# Altium schematic sheet TPI_time_timer.SchDoc
size A2; SheetNumber: 1; SheetTotal: 1
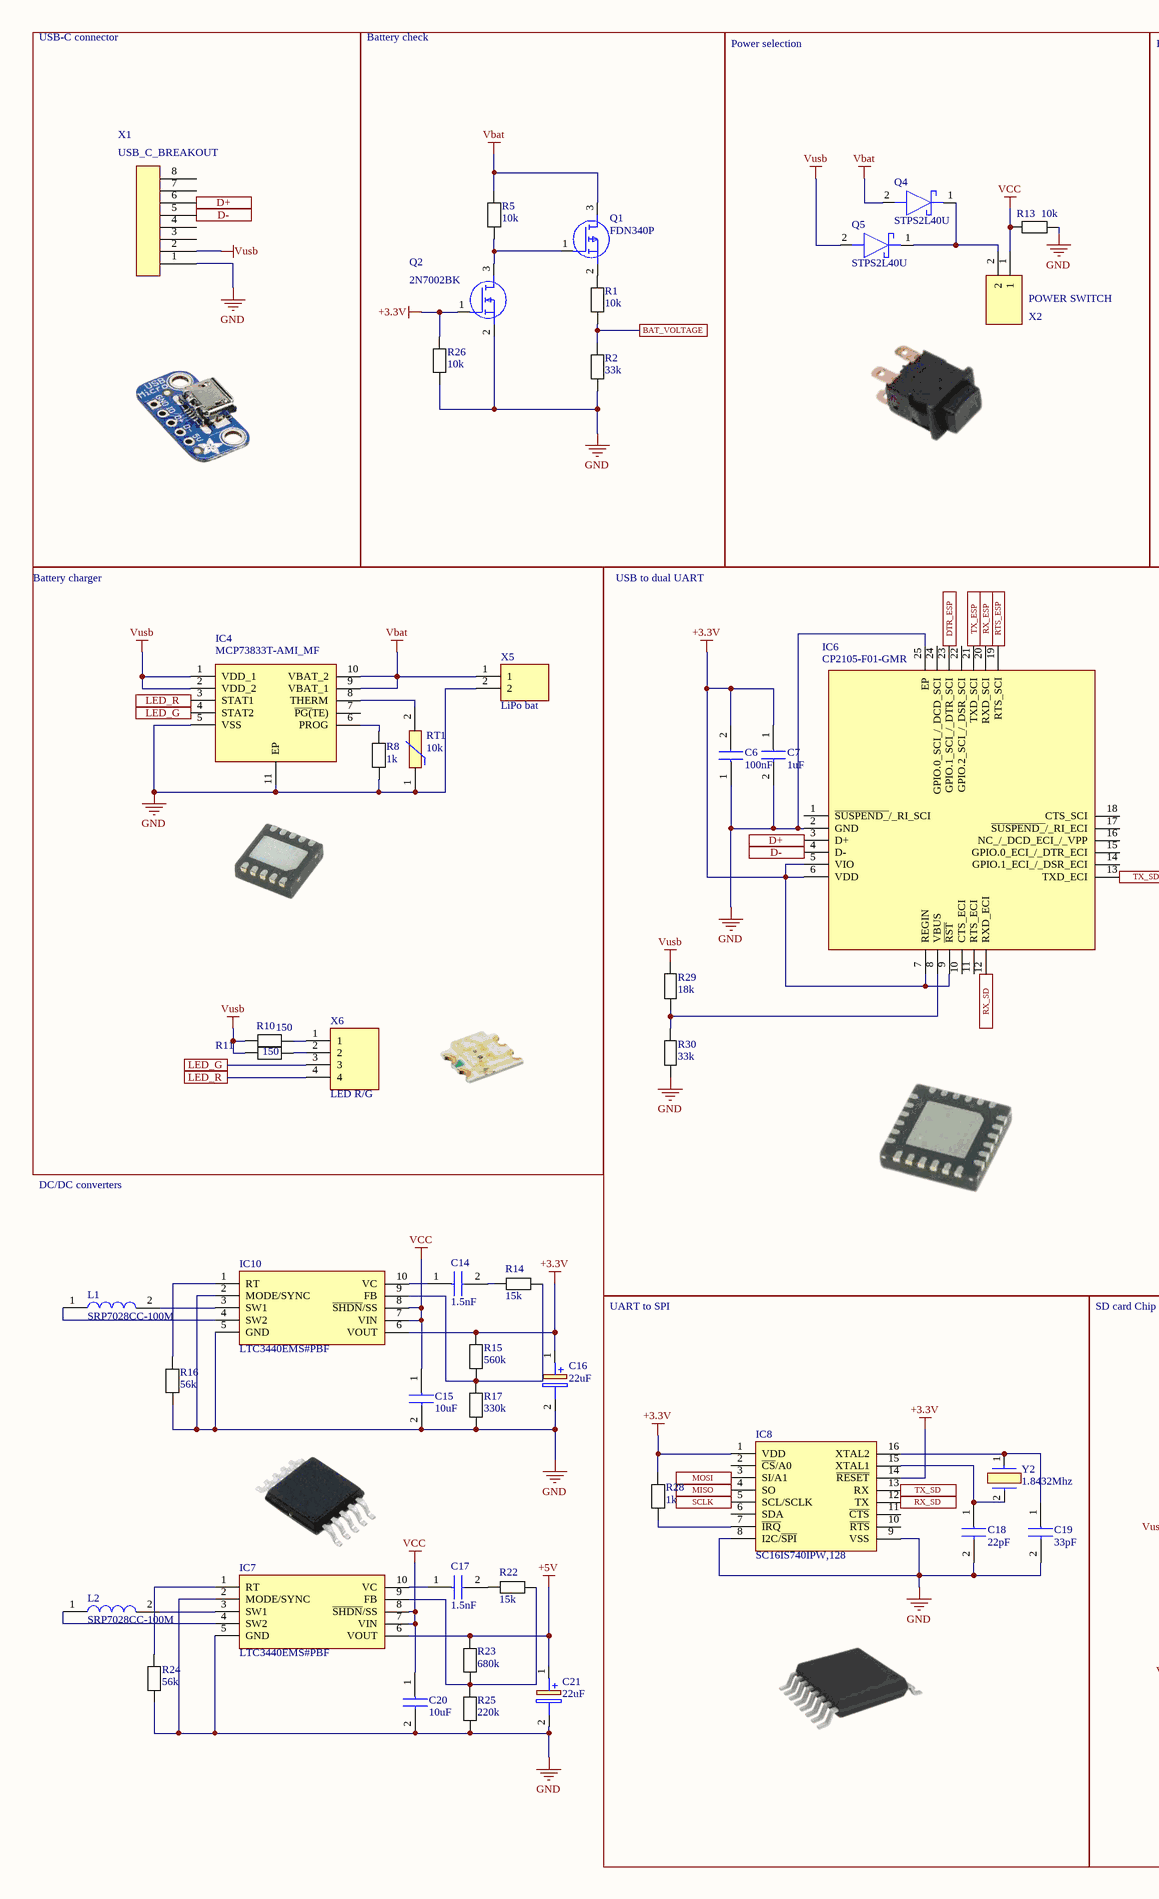
[diagram p0: TPI_time_timer.SchDoc, left]
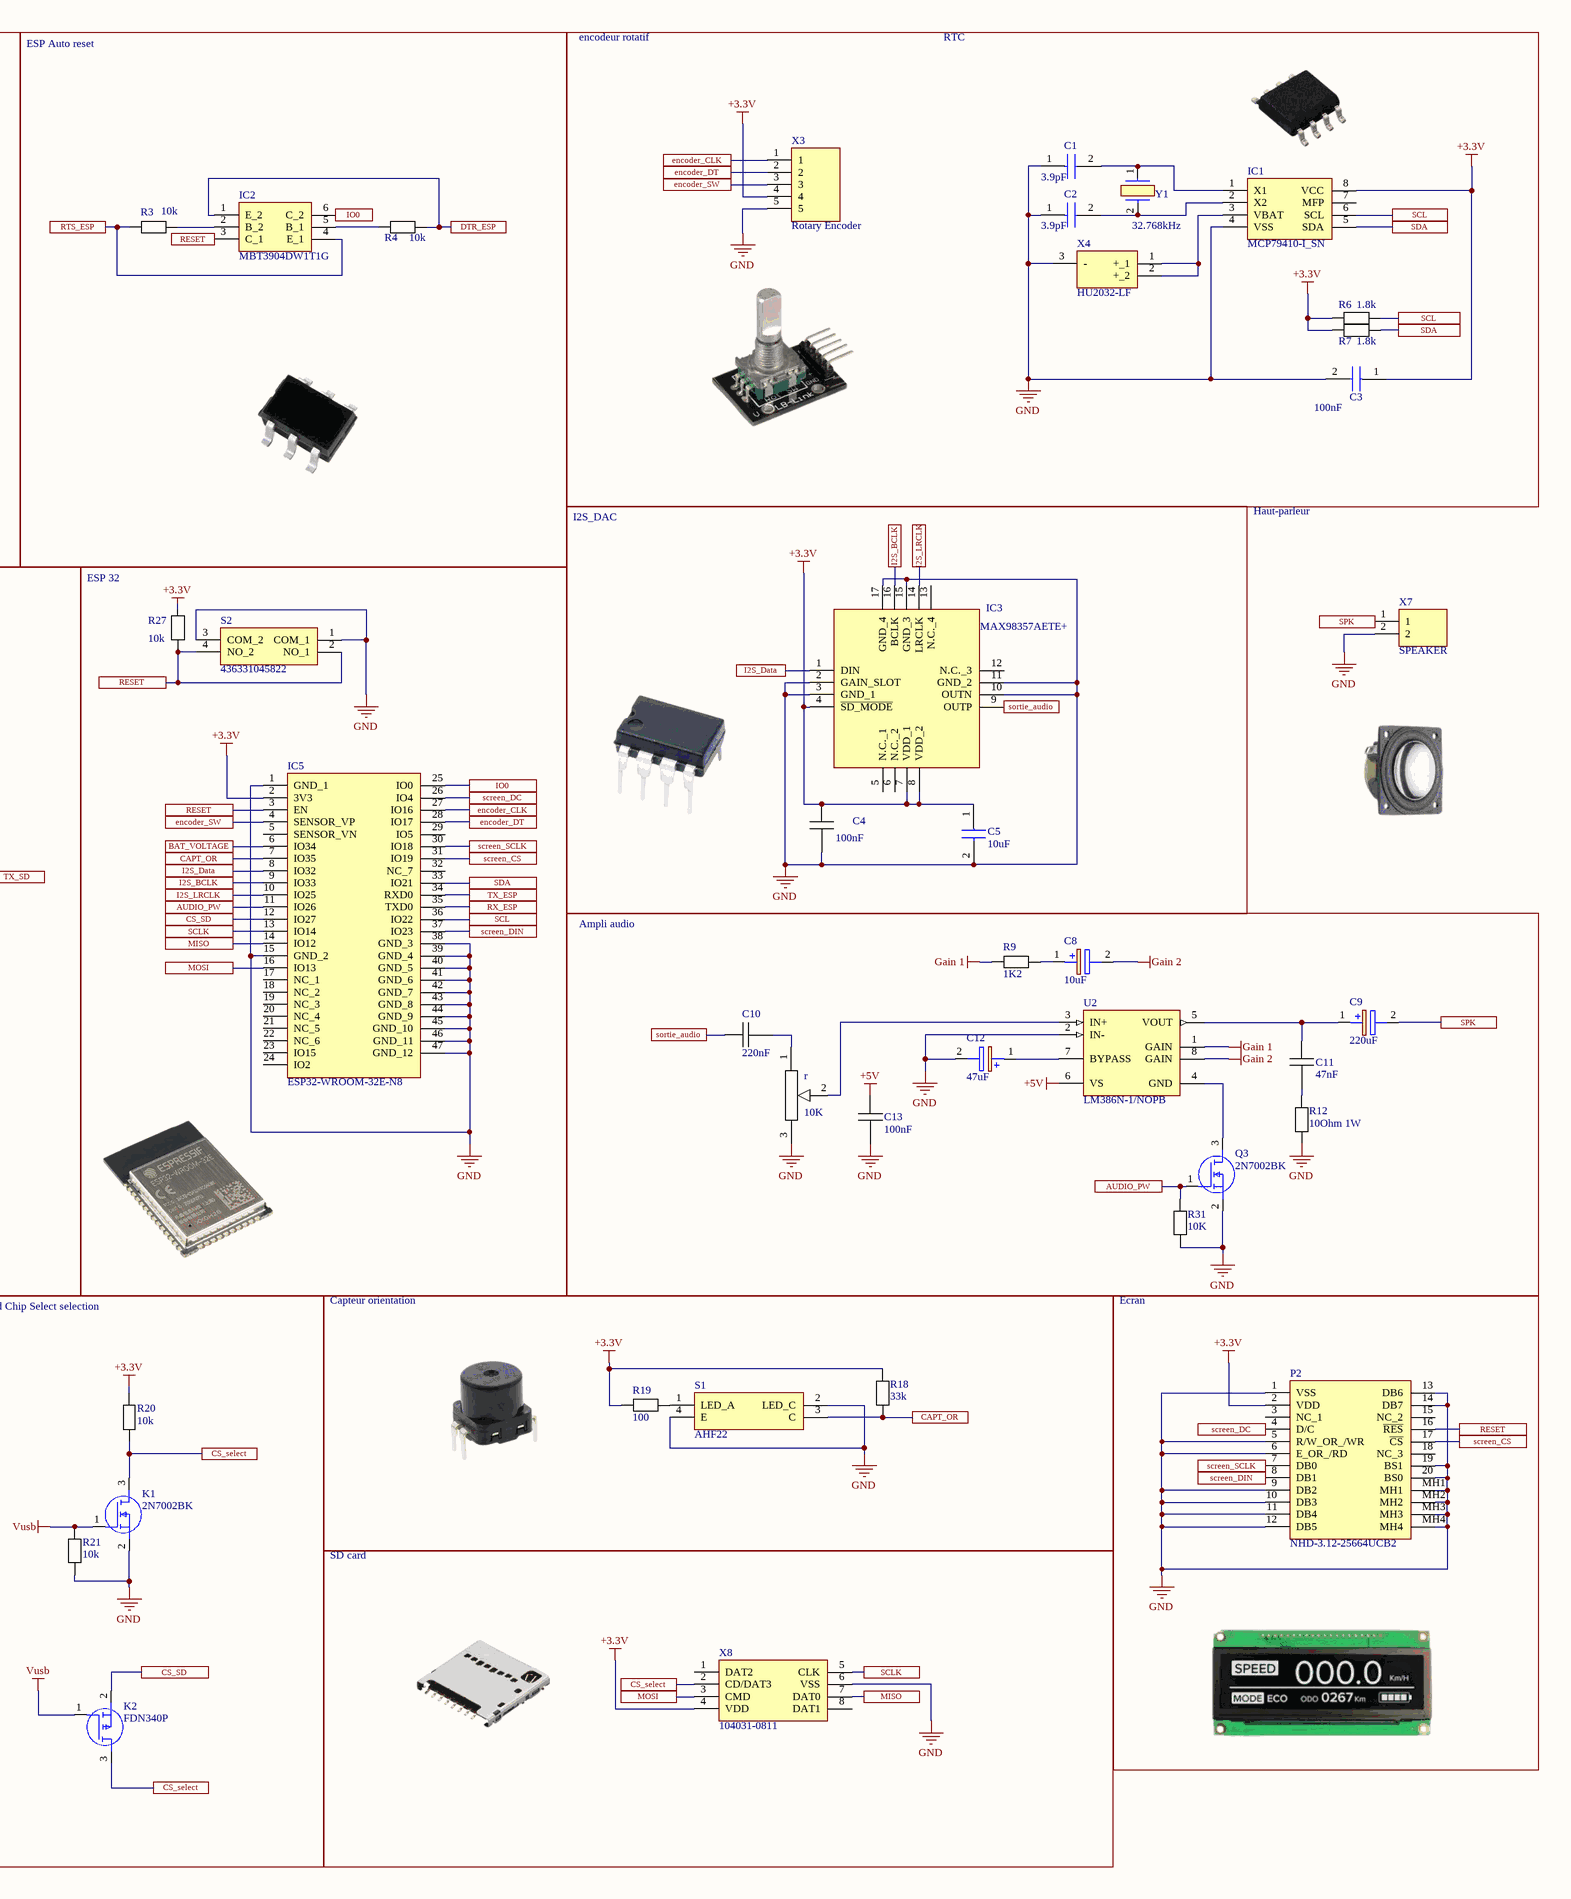
[diagram p1: TPI_time_timer.SchDoc, right]

## Parts
C1  3.9pF  [CAPC2012X88N]
C2  3.9pF  [CAPC2012X88N]
C3  100nF  [CAPC2012X94N]
C4  100nF  [MyCapacitor 1206 [SMD]]
C5  10uF  [C1206]
C6  100nF  [MyCapacitor 1206 [SMD]]
C7  1uF  [MyCapacitor 1206 [SMD]]
C8  10uF  [CAPAE530X550N]
C9  220uF  [CAPAE1030X1050N]
C10  220nF  [MyCapacitor 1206 [SMD]]
C11  47nF  [MyCapacitor 1206 [SMD]]
C12  47uF  [EEHZT1E561UV]
C13  100nF  [MyCapacitor 1206 [SMD]]
C14  1.5nF  [MyCapacitor 1206 [SMD]]
C15  10uF  [C1206]
C16  22uF  [CAPAE1030X1310N]
C17  1.5nF  [MyCapacitor 1206 [SMD]]
C18  22pF  [C1206]
C19  33pF  [C1206]
C20  10uF  [C1206]
C21  22uF  [CAPAE1030X1310N]
IC1  MCP79410-I_SN  [SOIC127P600X175-8N]
IC2  MBT3904DW1T1G  [SOT65P210X110-6N]
IC3  MAX98357AETE+  [QFN50P300X300X80-17N]
IC4  MCP73833T-AMI_MF  [SON50P300X300X100-11N-D]
IC5  ESP32-WROOM-32E-N8  [ESP32WROOM32EN8]
IC6  CP2105-F01-GMR  [QFN50P400X400X80-25N-D]
IC7  LTC3440EMS#PBF  [SOP50P490X110-10N]
IC8  SC16IS740IPW,128  [SOP65P640X110-16N]
IC10  LTC3440EMS#PBF  [SOP50P490X110-10N]
K1  2N7002BK  [TL431CDBZR215]
K2  FDN340P  [SOT95P251X112-3N]
L1  SRP7028CC-100M  [INDPM7366X300N]
L2  SRP7028CC-100M  [INDPM7366X300N]
P2  NHD-3.12-25664UCB2  [NHD31225664UCB2]
Q1  FDN340P  [SOT95P251X112-3N]
Q2  2N7002BK  [TL431CDBZR215]
Q3  2N7002BK  [TL431CDBZR215]
Q4  STPS2L40U  [DIOM5436X265N]
Q5  STPS2L40U  [DIOM5436X265N]
r  10K  [PVG3A103C01R00]
R1  10k  [Resistor 1206]
R2  33k  [Resistor 1206]
R3  10k  [Resistor 1206]
R4  10k  [Resistor 1206]
R5  10k  [Resistor 1206]
R6  1.8k  [Resistor 1206]
R7  1.8k  [Resistor 1206]
R8  1k  [Resistor 1206]
R9  1K2  [Resistor 1206]
R10  150  [Resistor 1206]
R11  150  [Resistor 1206]
R12  10Ohm 1W  [Resistor sandard tr.]
R13  10k  [Resistor 1206]
R14  15k  [Resistor 1206]
R15  560k  [Resistor 1206]
R16  56k  [Resistor 1206]
R17  330k  [Resistor 1206]
R18  33k  [Resistor 1206]
R19  100  [Resistor 1206]
R20  10k  [Resistor 1206]
R21  10k  [Resistor 1206]
R22  15k  [Resistor 1206]
R23  680k  [Resistor 1206]
R24  56k  [Resistor 1206]
R25  220k  [Resistor 1206]
R26  10k  [Resistor 1206]
R27  10k  [Resistor 1206]
R28  1k  [Resistor 1206]
R29  18k  [Resistor 1206]
R30  33k  [Resistor 1206]
R31  10K  [Resistor 1206]
RT1  10k  [NTCLE203E3103GB0]
S1  AHF22  [AHF22]
S2  436331045822  [436331045822]
U2  LM386N-1/NOPB  [P0008A]
X1  USB_C_BREAKOUT  [USB_C_BREAKOUT]
X2  POWER SWITCH  [B2BXHAMLFSN]
X3  Rotary Encoder  [B5BXHAMLFSN]
X4  HU2032-LF  [HU2032LF]
X5  LiPo bat  [B2BXHAMLFSN]
X6  LED R/G  [Header 4pin 2,54mm]
X7  SPEAKER  [B2BXHAMLFSN]
X8  104031-0811  [1040310811]
Y1  32.768kHz  [Q13FC1350000212]
Y2  1.8432Mhz  [CC1AT1A]

## Blocks framed on the sheet
USB-C connector: X1
Battery check: Q1 Q2 R1 R2 R5 R26
Power selection: Q4 Q5 R13 X2
ESP Auto reset: IC2 R3 R4
I2S_DAC: C4 C5 IC3
Battery charger: IC4 R8 R10 R11 RT1 X5 X6
USB to dual UART: C6 C7 IC6 R29 R30
ESP 32: IC5 R27 S2
Ampli audio: C8-C13 Q3 r R9 R12 R31 U2
UART to SPI: C18 C19 IC8 R28 Y2
SD card Chip Select selection: K1 K2 R20 R21
Capteur orientation: R18 R19 S1
Ecran: P2
SD card: X8

## Ports
AUDIO_PW (see TPI_time_timer[4B]), AUDIO_PW (see TPI_time_timer[7C]), BAT_VOLTAGE (see TPI_time_timer[2A]), BAT_VOLTAGE (see TPI_time_timer[4B]), CAPT_OR (see TPI_time_timer[4B]), CAPT_OR (see TPI_time_timer[7C]), CS_SD (see TPI_time_timer[4B]), CS_SD (see TPI_time_timer[4D]), CS_select (see TPI_time_timer[4D]), CS_select (see TPI_time_timer[4D], TPI_time_timer[6D]), D+ (see TPI_time_timer[1A]), D+ (see TPI_time_timer[3B]), D- (see TPI_time_timer[1A]), D- (see TPI_time_timer[3B]), DTR_ESP (see TPI_time_timer[3B]), DTR_ESP (see TPI_time_timer[5A]), encoder_CLK (see TPI_time_timer[5B]), encoder_CLK (see TPI_time_timer[6A]), encoder_DT (see TPI_time_timer[5B]), encoder_DT (see TPI_time_timer[6A]), encoder_SW (see TPI_time_timer[4B]), encoder_SW (see TPI_time_timer[6A]), I2S_BCLK (see TPI_time_timer[4B]), I2S_BCLK (see TPI_time_timer[6B]), I2S_Data (see TPI_time_timer[4B]), I2S_Data (see TPI_time_timer[6B]), I2S_LRCLK (see TPI_time_timer[4B]), I2S_LRCLK (see TPI_time_timer[7B]), IO0 (see TPI_time_timer[5A]), IO0 (see TPI_time_timer[5B]), LED_G (see TPI_time_timer[1B]), LED_G (see TPI_time_timer[1C]), LED_R (see TPI_time_timer[1B]), LED_R (see TPI_time_timer[1C]), MISO (see TPI_time_timer[3D], TPI_time_timer[4B]), MISO (see TPI_time_timer[3D], TPI_time_timer[6D]), MISO (see TPI_time_timer[4B], TPI_time_timer[6D]), MOSI (see TPI_time_timer[3D], TPI_time_timer[4C]), MOSI (see TPI_time_timer[3D], TPI_time_timer[6D]), MOSI (see TPI_time_timer[4C], TPI_time_timer[6D]), RESET (see TPI_time_timer[4A], TPI_time_timer[4B]), RESET (see TPI_time_timer[4A], TPI_time_timer[4B], TPI_time_timer[8D]), RESET (see TPI_time_timer[4B], TPI_time_timer[8D]), RTS_ESP (see TPI_time_timer[3B]), RTS_ESP (see TPI_time_timer[4A]), RX_ESP (see TPI_time_timer[3B]), RX_ESP (see TPI_time_timer[5B]), RX_SD (see TPI_time_timer[3C]), RX_SD (see TPI_time_timer[3D]), SCL (see TPI_time_timer[5B], TPI_time_timer[8A]), SCL (see TPI_time_timer[8A]), SCLK (see TPI_time_timer[3D], TPI_time_timer[4B]), SCLK (see TPI_time_timer[3D], TPI_time_timer[6D]), SCLK (see TPI_time_timer[4B], TPI_time_timer[6D]), screen_CS (see TPI_time_timer[5B]), screen_CS (see TPI_time_timer[8D]), screen_DC (see TPI_time_timer[5B]), screen_DC (see TPI_time_timer[7D]), screen_DIN (see TPI_time_timer[5B]), screen_DIN (see TPI_time_timer[7D]), screen_SCLK (see TPI_time_timer[5B]), screen_SCLK (see TPI_time_timer[7D]), SDA (see TPI_time_timer[5B], TPI_time_timer[8A]), SDA (see TPI_time_timer[8A]), sortie_audio (see TPI_time_timer[6C]), sortie_audio (see TPI_time_timer[7B]), SPK (see TPI_time_timer[8B]), SPK (see TPI_time_timer[8C]), TX_ESP (see TPI_time_timer[3B]), TX_ESP (see TPI_time_timer[5B]), TX_SD (see TPI_time_timer[3D]), TX_SD (see TPI_time_timer[4B])

## Nets
+3.3V: C3.1 C4.2 C5.1 C6.2 C7.1 C16.1(+) IC1.8(VCC) IC3.4(~{SD_MODE}) IC3.7(VDD_1) IC3.8(VDD_2) IC5.2(3V3) IC6.5(VIO) IC6.6(VDD) IC6.7(REGIN) IC6.9(~{RST}) IC8.1(VDD) IC8.14(~{RESET}) IC10.6(VOUT) P2.2(VDD) Q2.1(G) R6.2 R7.2 R15.1 R18.2 R19.2 R20.1 R26.1 R27.1 R28.1 X3.4 X8.4(VDD)
+5V: C13.2 C21.1(+) IC7.6(VOUT) R23.1 U2.6(VS)
Gain 1: R9.1 U2.1(GAIN)
Gain 2: C8.2(-) U2.8(GAIN)
GND: C1.1 C2.1 C3.2 C4.1 C5.2 C6.1 C7.2 C12.2(-_1) C13.1 C15.2 C16.2(-) C18.2 C19.2 C20.2 C21.2(-) IC1.4(VSS) IC3.2(GAIN_SLOT) IC3.3(GND_1) IC3.10(OUTN) IC3.11(GND_2) IC3.15(GND_3) IC3.17(GND_4) IC4.5(VSS) IC4.11(EP) IC5.1(GND_1) IC5.15(GND_2) IC5.38(GND_3) IC5.39(GND_4) IC5.40(GND_5) IC5.41(GND_6) IC5.42(GND_7) IC5.43(GND_8) IC5.44(GND_9) IC5.45(GND_10) IC5.46(GND_11) IC5.47(GND_12) IC6.2(GND) IC6.25(EP) IC7.2(MODE/SYNC) IC7.5(GND) IC8.8(I2C/~{SPI}) IC8.9(VSS) IC10.2(MODE/SYNC) IC10.5(GND) K1.2(S) P2.1(VSS) P2.5(R/W_OR_/WR) P2.6(E_OR_/RD) P2.9(DB2) P2.10(DB3) P2.11(DB4) P2.12(DB5) P2.13(DB6) P2.14(DB7) P2.19(BS1) P2.20(BS0) P2.MH1 P2.MH2 P2.MH3 P2.MH4 Q2.2(S) Q3.2(S) r.3 R2.2 R8.2 R12.2 R13.1 R16.2 R17.2 R21.1 R24.2 R25.2 R26.2 R30.1 R31.2 RT1.1 S1.2(LED_C) S1.4(E) S2.1(COM_1) S2.3(COM_2) U2.2(IN-) X1.1 X3.5 X4.3(-) X5.2 X7.2 X8.6(VSS)
Vbat: IC4.9(VBAT_1) IC4.10(VBAT_2) Q1.3(D) Q4.2(A) R5.1 X5.1
VCC: C15.1 C20.1 IC7.7(VIN) IC7.8(~{SHDN}/SS) IC10.7(VIN) IC10.8(~{SHDN}/SS) R13.2 X2.1
Vusb: IC4.1(VDD_1) IC4.2(VDD_2) K1.1(G) K2.1(G) Q5.2(A) R10.1 R11.1 R21.2 R29.2 X1.2
AUDIO_PW: IC5.11(IO26) Q3.1(G) R31.1 ; port AUDIO_PW
BAT_VOLTAGE: IC5.6(IO34) R1.2 R2.1 ; port BAT_VOLTAGE
CAPT_OR: IC5.7(IO35) R18.1 S1.3(C) ; port CAPT_OR
CS_SD: IC5.12(IO27) K2.2(S) ; port CS_SD
CS_select: K1.3(D) K2.3(D) R20.2 X8.2(CD/DAT3) ; port CS_select
D+: IC6.3(D+) X1.6 ; port D+
D-: IC6.4(D-) X1.5 ; port D-
DTR_ESP: IC2.1(E_2) IC6.23(GPIO.1_SCI_/_DTR_SCI) R4.2 ; port DTR_ESP
encoder_CLK: IC5.27(IO16) X3.1 ; port encoder_CLK
encoder_DT: IC5.28(IO17) X3.2 ; port encoder_DT
encoder_SW: IC5.4(SENSOR_VP) X3.3 ; port encoder_SW
I2S_BCLK: IC3.16(BCLK) IC5.9(IO33) ; port I2S_BCLK
I2S_Data: IC3.1(DIN) IC5.8(IO32) ; port I2S_Data
I2S_LRCLK: IC3.14(LRCLK) IC5.10(IO25) ; port I2S_LRCLK
IO0: IC2.6(C_2) IC5.25(IO0) ; port IO0
LED_G: IC4.4(STAT2) X6.3 ; port LED_G
LED_R: IC4.3(STAT1) X6.4 ; port LED_R
MISO: IC5.14(IO12) IC8.4(SO) X8.7(DAT0) ; port MISO
MOSI: IC5.16(IO13) IC8.3(SI/A1) X8.3(CMD) ; port MOSI
RESET: IC2.3(C_1) IC5.3(EN) P2.16(~{RES}) R27.2 S2.2(NO_1) S2.4(NO_2) ; port RESET
RTS_ESP: IC2.4(E_1) IC6.19(RTS_SCI) R3.1 ; port RTS_ESP
RX_ESP: IC5.35(TXD0) IC6.20(RXD_SCI) ; port RX_ESP
RX_SD: IC6.12(RXD_ECI) IC8.12(TX) ; port RX_SD
SCL: IC1.6(SCL) IC5.36(IO22) R6.1 ; port SCL
SCLK: IC5.13(IO14) IC8.5(SCL/SCLK) X8.5(CLK) ; port SCLK
screen_CS: IC5.31(IO19) P2.17(~{CS}) ; port screen_CS
screen_DC: IC5.26(IO4) P2.4(D/C) ; port screen_DC
screen_DIN: IC5.37(IO23) P2.8(DB1) ; port screen_DIN
screen_SCLK: IC5.30(IO18) P2.7(DB0) ; port screen_SCLK
SDA: IC1.5(SDA) IC5.33(IO21) R7.1 ; port SDA
sortie_audio: C10.2 IC3.9(OUTP) ; port sortie_audio
SPK: C9.2(-) X7.1 ; port SPK
TX_ESP: IC5.34(RXD0) IC6.21(TXD_SCI) ; port TX_ESP
TX_SD: IC6.13(TXD_ECI) IC8.13(RX) ; port TX_SD
NetC1_2: C1.2 IC1.1(X1) Y1.1
NetC2_2: C2.2 IC1.2(X2) Y1.2
NetC8_1: C8.1(+) R9.2
NetC9_1: C9.1(+) C11.2 U2.5(VOUT)
NetC10_1: C10.1 r.1
NetC11_1: C11.1 R12.1
NetC12_1: C12.1(+_1) U2.7(BYPASS)
NetC14_1: C14.1 IC10.10(VC)
NetC14_2: C14.2 R14.1
NetC17_1: C17.1 IC7.10(VC)
NetC17_2: C17.2 R22.1
NetC18_1: C18.1 IC8.15(XTAL1) Y2.2(OUTPUT)
NetC19_1: C19.1 IC8.16(XTAL2) Y2.1
NetIC1_3: IC1.3(VBAT) X4.1(+_1) X4.2(+_2)
NetIC2_2: IC2.2(B_2) R3.2
NetIC2_5: IC2.5(B_1) R4.1
NetIC4_6: IC4.6(PROG) R8.1
NetIC4_8: IC4.8(THERM) RT1.2
NetIC6_8: IC6.8(VBUS) R29.1 R30.2
NetIC7_1: IC7.1(RT) R24.1
NetIC7_3: IC7.3(SW1) L2.2
NetIC7_4: IC7.4(SW2) L2.1
NetIC7_9: IC7.9(FB) R22.2 R23.2 R25.1
NetIC8_7: IC8.7(~{IRQ}) R28.2
NetIC10_1: IC10.1(RT) R16.1
NetIC10_3: IC10.3(SW1) L1.2
NetIC10_4: IC10.4(SW2) L1.1
NetIC10_9: IC10.9(FB) R14.2 R15.2 R17.1
NetQ1_1: Q1.1(G) Q2.3(D) R5.2
NetQ1_2: Q1.2(S) R1.1
NetQ3_3: Q3.3(D) U2.4(GND)
NetQ4_1: Q4.1(K) Q5.1(K) X2.2
NetR10_2: R10.2 X6.1
NetR11_2: R11.2 X6.2
NetR19_1: R19.1 S1.1(LED_A)
Netr_2: r.2 U2.3(IN+)

Not connected (* = marked no-connect by the designer): IC1 7(MFP); IC3 5(N.C._1) 6(N.C._2) 12(N.C._3) 13(N.C._4); IC4 7(~{PG(}TE)); IC5 5(SENSOR_VN) 17(NC_1) 18(NC_2) 19(NC_3) 20(NC_4) 21(NC_5) 22(NC_6) 23(IO15) 24(IO2) 29(IO5) 32(NC_7); IC6 1(~{SUSPEND_}/_RI_SCI) 10(CTS_ECI) 11(RTS_ECI) 14(GPIO.1_ECI_/_DSR_ECI) 15(GPIO.0_ECI_/_DTR_ECI) 16(NC_/_DCD_ECI_/_VPP) 17(~{SUSPEND_}/_RI_ECI) 18(CTS_SCI) 22(GPIO.2_SCI_/_DSR_SCI) 24(GPIO.0_SCI_/_DCD_SCI); IC8 2(~{CS}/A0) 6(SDA) 10(~{RTS}) 11(~{CTS}); P2 3(NC_1) 15(NC_2) 18(NC_3); X1 3(65) 4(64) 7(61) 8(60); X8 1(DAT2) 8(DAT1)

## Notes on the sheet
- encodeur rotatif
- RTC
- Haut-parleur
- DC/DC converters

## Library data of the parts
C1 C2 = C0805C399D5GAC7800: Capacitor; Manufacturer_Name: KEMET; Datasheet Link: https://connect.kemet.com:7667/gateway/IntelliData-ComponentDocumentation/1.0/download/specsheet/C0805C399D5GACTU; Height: 0.88mm; Manufacturer_Part_Number: C0805C399D5GAC7800; Mouser Part Number: N/A; Mouser Price/Stock: https://www.mouser.co.uk/ProductDetail/KEMET/C0805C399D5GAC7800?qs=HB7DuPrg59p8fcBF%252BMtP%252BQ%3D%3D
C3 C6 = 08053C104MAT2A: Capacitor; Manufacturer_Name: AVX; Datasheet Link: https://spicat.kyocera-avx.com/product/mlcc/chartview/08053C104MAT2A/DataSheet/X7R; Height: 0.94mm; Manufacturer_Part_Number: 08053C104MAT2A; Mouser Part Number: 581-08053C104M; Mouser Price/Stock: https://www.mouser.co.uk/ProductDetail/AVX/08053C104MAT2A?qs=iAmswNBQWa3yww%252Bhw1tBQA%3D%3D; Arrow Part Number: 08053C104MAT2A; Arrow Price/Stock: https://www.arrow.com/en/products/08053c104mat2a/avx
C4 C10 C11 C13 = Condo non polarisé
C5 C7 C15 C18-C20 = C1206C106K4RACTU: Capacitor; Manufacturer_Name: KEMET; Datasheet Link: https://content.kemet.com/datasheets/KEM_C1002_X7R_SMD.pdf; Manufacturer_Part_Number: C1206C106K4RACTU; Mouser Part Number: 80-C1206C106K4R; Mouser Price/Stock: https://www.mouser.co.uk/ProductDetail/KEMET/C1206C106K4RACTU?qs=guDyKOyRtV0mxqxQedB7kA%3D%3D; Arrow Part Number: C1206C106K4RACTU; Arrow Price/Stock: https://www.arrow.com/en/products/c1206c106k4ractu/kemet-corporation?region=nac
C8 = 865230542002: Capacitor Polarised; Manufacturer_Name: Wurth Elektronik; Datasheet Link: http://katalog.we-online.com/pbs/datasheet/865230542002.pdf; Height: 5.5mm; Manufacturer_Part_Number: 865230542002; Mouser Part Number: 710-865230542002; Mouser Price/Stock: https://www.mouser.co.uk/ProductDetail/Wurth-Elektronik/865230542002?qs=0KOYDY2FL2%2F9Zrx1rvGWxQ%3D%3D
C9 = A785MN826M1JLAS030: Capacitor Polarised; Manufacturer_Name: KEMET; Datasheet Link: https://www.mouser.co.uk/datasheet/2/447/KEM_A4125_A785-3368732.pdf; Height: 10.5mm; Manufacturer_Part_Number: A785MN826M1JLAS030; Mouser Part Number: 80-A785MN826M1JLAS30; Mouser Price/Stock: https://www.mouser.co.uk/ProductDetail/KEMET/A785MN826M1JLAS030?qs=HoCaDK9Nz5cVflOfO51YlQ%3D%3D
C12 = EEH-ZA1K470V: Capacitor Polarised; Manufacturer_Name: Panasonic; Datasheet Link: http://industrial.panasonic.com/cdbs/www-data/pdf/RDD0000/ABA0000C1221.pdf; Height: 10.5mm; Manufacturer_Part_Number: EEH-ZA1K470V; Mouser Part Number: 667-EEH-ZA1K470V; Mouser Price/Stock: https://www.mouser.co.uk/ProductDetail/Panasonic/EEH-ZA1K470V?qs=1Kr7Jg1SGW%2FtZcuby2Gpxw%3D%3D
C14 C17 = C0402C152KCRACAUTO: Capacitor; Manufacturer_Name: KEMET; Datasheet Link: https://www.mouser.com/datasheet/2/447/KEM_C1076_X7R_HV_AUTO_SMD-3316842.pdf; Height: 0.6mm; Manufacturer_Part_Number: C0402C152KCRACAUTO; Mouser Part Number: 80-C0402C152KCRAUTO; Mouser Price/Stock: https://www.mouser.co.uk/ProductDetail/KEMET/C0402C152KCRACAUTO?qs=1Kr7Jg1SGW8RiYGiZabm2g%3D%3D
C16 C21 = PCM1J101MCL1GS: Capacitor Polarised; Manufacturer_Name: Nichicon; Datasheet Link: https://www.nichicon.co.jp/english/series_items/catalog_pdf/e-pcm.pdf; Height: 13.1mm; Manufacturer_Part_Number: PCM1J101MCL1GS
IC1 = MCP79410-I_SN: Integrated Circuit; Manufacturer_Name: Microchip; Manufacturer_Part_Number: MCP79410-I/SN; Datasheet Link: https://datasheet.datasheetarchive.com/originals/distributors/Datasheets-DGA3/278325.pdf; Height: 1.75mm; Mouser Part Number: 579-MCP79410-I/SN; Mouser Price/Stock: https://www.mouser.co.uk/ProductDetail/Microchip-Technology-Atmel/MCP79410-I-SN?qs=LU7oW20kJpNhp%252BQbxumdTQ%3D%3D; Arrow Part Number: MCP79410-I/SN; Arrow Price/Stock: https://www.arrow.com/en/products/mcp79410-isn/microchip-technology?region=nac
IC2 = MBT3904DW1T1G: Integrated Circuit; Manufacturer_Name: onsemi; Datasheet Link: http://www.onsemi.com/pub/Collateral/MBT3904DW1T1-D.PDF; Height: 1.1mm; Manufacturer_Part_Number: MBT3904DW1T1G; Mouser Part Number: 863-MBT3904DW1T1G; Mouser Price/Stock: https://www.mouser.co.uk/ProductDetail/onsemi/MBT3904DW1T1G?qs=3JMERSakebosaBSFCYL6kw%3D%3D; Arrow Part Number: MBT3904DW1T1G; Arrow Price/Stock: https://www.arrow.com/en/products/mbt3904dw1t1g/on-semiconductor?region=nac
IC3 = MAX98357AETE+: Integrated Circuit; Manufacturer_Name: Analog Devices; Datasheet Link: https://datasheets.maximintegrated.com/en/ds/MAX98357A-MAX98357B.pdf; Height: 0.8mm; Manufacturer_Part_Number: MAX98357AETE+; Mouser Part Number: 700-MAX98357AETE+; Mouser Price/Stock: https://www.mouser.co.uk/ProductDetail/Analog-Devices-Maxim-Integrated/MAX98357AETE%2b?qs=AAveGqk956EyS6m3AmZeuw%3D%3D
IC4 = MCP73833T-AMI_MF: Integrated Circuit; Manufacturer_Name: Microchip; Manufacturer_Part_Number: MCP73833T-AMI/MF; Datasheet Link: https://datasheet.datasheetarchive.com/originals/distributors/SFDatasheet-4/sf-00090109.pdf; Height: 1mm; Mouser Part Number: 579-MCP73833T-AMI/MF; Mouser Price/Stock: https://www.mouser.co.uk/ProductDetail/Microchip-Technology/MCP73833T-AMI-MF?qs=Fxu3fLyJv8epbqy6GsGQQA%3D%3D; Arrow Part Number: MCP73833T-AMI/MF; Arrow Price/Stock: https://www.arrow.com/en/products/mcp73833t-amimf/microchip-technology?region=nac
IC5 = ESP32-WROOM-32E-N8: Integrated Circuit; Manufacturer_Name: Espressif Systems; Datasheet Link: https://www.google.com/url?sa=t&rct=j&q=&esrc=s&source=web&cd=&ved=2ahUKEwjLw4ysybv2AhXFzIUKHZUbB64QFnoECCwQAQ&url=https%3A%2F%2Fwww.espressif.com%2Fsites%2Fdefault%2Ffiles%2Fdocumentation%2Fesp32-wroom-32e_esp32-wroom-32ue_datasheet_en.pdf&usg=AOvVaw1xSL; Height: 3.25mm; Manufacturer_Part_Number: ESP32-WROOM-32E-N8; Mouser Part Number: 356-ESP32WRM32E164PH; Mouser Price/Stock: https://www.mouser.co.uk/ProductDetail/Espressif-Systems/ESP32-WROOM-32E-N8?qs=Li%252BoUPsLEnsLnZW%252BGLgUhw%3D%3D
IC6 = CP2105-F01-GMR: Integrated Circuit; Manufacturer_Name: Silicon Labs; Datasheet Link: https://www.silabs.com/documents/public/data-sheets/CP2105.pdf; Height: 0.8mm; Manufacturer_Part_Number: CP2105-F01-GMR; Mouser Part Number: 634-CP2105-F01-GMR; Mouser Price/Stock: https://www.mouser.co.uk/ProductDetail/Silicon-Labs/CP2105-F01-GMR?qs=1CB38rTTsYoc5Zql7SRZ%2Fw%3D%3D; Arrow Part Number: CP2105-F01-GMR; Arrow Price/Stock: https://www.arrow.com/en/products/cp2105-f01-gmr/silicon-labs?region=nac
IC7 IC10 = LTC3440EMS#PBF: Integrated Circuit; Manufacturer_Name: Analog Devices; Datasheet Link: https://www.analog.com/media/en/technical-documentation/data-sheets/3440fd.pdf; Height: 1.1mm; Manufacturer_Part_Number: LTC3440EMS#PBF; Mouser Part Number: 584-LTC3440EMS#PBF; Mouser Price/Stock: https://www.mouser.co.uk/ProductDetail/Analog-Devices/LTC3440EMSPBF?qs=hVkxg5c3xu%2F50%252Bg90voenw%3D%3D; Arrow Part Number: LTC3440EMS#PBF; Arrow Price/Stock: https://www.arrow.com/en/products/ltc3440emspbf/analog-devices?region=nac
IC8 = SC16IS740IPW,128: Integrated Circuit; Manufacturer_Name: NXP; Datasheet Link: http://www.nxp.com/docs/en/data-sheet/SC16IS740_750_760.pdf; Height: 1.1mm; Manufacturer_Part_Number: SC16IS740IPW,128; Mouser Part Number: 771-SC16IS0IPW128; Mouser Price/Stock: https://www.mouser.co.uk/ProductDetail/NXP-Semiconductors/SC16IS740IPW128?qs=LOCUfHb8d9tH8aPSiCB%2F4g%3D%3D; Arrow Part Number: SC16IS740IPW,128; Arrow Price/Stock: https://www.arrow.com/en/products/sc16is740ipw128/nxp-semiconductors?region=nac
K1 Q2 Q3 = 2N7002BK: MOSFET (N-Channel); Manufacturer_Name: Nexperia; Datasheet Link: https://componentsearchengine.com/Datasheets/2/2N7002BK.pdf; Height: 1.1mm; Manufacturer_Part_Number: 2N7002BK; Mouser Part Number: N/A; Mouser Price/Stock: https://www.mouser.co.uk/ProductDetail/Nexperia/2N7002BK?qs=vHuUswq2%252Bsy7zq%252BdG1DqyA%3D%3D
K2 Q1 = FDN340P: MOSFET (P-Channel); Manufacturer_Name: Rochester Electronics; Height: 1.12mm; Manufacturer_Part_Number: FDN340P
L1 L2 = SRP7028CC-100M: Inductor; Manufacturer_Name: Bourns; Datasheet Link: https://www.bourns.com/docs/Product-Datasheets/SRP7028CC.pdf; Height: 3mm; Manufacturer_Part_Number: SRP7028CC-100M; Mouser Part Number: 652-SRP7028CC-100M; Mouser Price/Stock: https://www.mouser.co.uk/ProductDetail/Bourns/SRP7028CC-100M?qs=1Kr7Jg1SGW%252BFrchEKUd2WQ%3D%3D
P2 = NHD-3.12-25664UCB2: Display; Manufacturer_Name: Newhaven Display; Datasheet Link: https://componentsearchengine.com/Datasheets/1/NHD-3.12-25664UCB2.pdf; Height: 3.5mm; Manufacturer_Part_Number: NHD-3.12-25664UCB2; Mouser Part Number: 763-3.12-25664UCB2; Mouser Price/Stock: https://www.mouser.co.uk/ProductDetail/Newhaven-Display/NHD-3.12-25664UCB2?qs=EQmeiuRlVUSDyFGBqw5j5w%3D%3D
Q4 Q5 = STPS2L40U: Schottky Diode; Manufacturer_Name: STMicroelectronics; Datasheet Link: https://www.st.com/resource/en/datasheet/stps2l40.pdf; Height: 2.65mm; Manufacturer_Part_Number: STPS2L40U; Mouser Part Number: 511-STPS2L40U; Mouser Price/Stock: https://www.mouser.co.uk/ProductDetail/STMicroelectronics/STPS2L40U?qs=JV7lzlMm3yIPHfBydn9ktg%3D%3D; Arrow Part Number: STPS2L40U; Arrow Price/Stock: https://www.arrow.com/en/products/stps2l40u/stmicroelectronics?region=nac
r = Trimmer
R1-R8 R10 R11 R13-R30 = Resistor 1206 [SMD]
R9 R12 R31 = Resistor
RT1 = NTCLE203E3103GB0: Thermistor; Manufacturer_Name: Vishay; Datasheet Link: https://componentsearchengine.com/Datasheets/2/NTCLE203E3103GB0.pdf; Height: 9mm; Manufacturer_Part_Number: NTCLE203E3103GB0; Mouser Part Number: 594-NTCLE203E3103GB0; Mouser Price/Stock: https://www.mouser.co.uk/ProductDetail/Vishay-BC-Components/NTCLE203E3103GB0?qs=8wHch9UpSva5qDw7iC%2Fpmw%3D%3D; Arrow Part Number: NTCLE203E3103GB0; Arrow Price/Stock: https://www.arrow.com/en/products/ntcle203e3103gb0/vishay
S1 = AHF22: Relay or Contactor; Manufacturer_Name: Panasonic; Datasheet Link: https://componentsearchengine.com/Datasheets/1/AHF22.pdf; Height: 9.3mm; Manufacturer_Part_Number: AHF22; Mouser Part Number: 769-AHF22; Mouser Price/Stock: https://www.mouser.co.uk/ProductDetail/Panasonic-Industrial-Devices/AHF22?qs=pVDBBu6HaAiqMC5Qh3hM%252Bw%3D%3D
S2 = 436331045822: Switch; Manufacturer_Name: Wurth Elektronik; Datasheet Link: https://www.we-online.com/components/products/datasheet/436331045822.pdf; Height: 1.65mm; Manufacturer_Part_Number: 436331045822; Mouser Part Number: 710-436331045822; Mouser Price/Stock: https://www.mouser.co.uk/ProductDetail/Wurth-Elektronik/436331045822?qs=wr8lucFkNMXz9UbduBxtIQ%3D%3D
U2 = CMP-0057-00052-4: Low Voltage Audio Power Amplifier, 8-pin MDIP, Pb-Free; Manufacturer: Texas Instruments; PackageTopMarking: NSUZXYTTE#*LM*386N-1; PowerWise: N; CompType: Audio IC; RoHS: Y; PackageReference: P0008A; Code_JEDEC: MS-001-BA; PackageDescription: MDIP, .365 x .250 x .130in, 8 Lead, .100in Pitch; PinCount: 8; ComponentLink1URL: http://www.ti.com/general/docs/lit/getliterature.tsp?genericPartNumber=LM386&fileType=pdf; ComponentLink1Description: Datasheet URL
X2 X5 X7 = B2B-XH-AM_LF__SN_: Connector; Manufacturer_Name: JST (JAPAN SOLDERLESS TERMINALS); Manufacturer_Part_Number: B2B-XH-AM(LF)(SN); Datasheet Link: https://www.jst-mfg.com/product/pdf/eng/eXH.pdf; Height: 7mm; Arrow Part Number: B2B-XH-AM(LF)(SN); Arrow Price/Stock: https://www.arrow.com/en/products/b2b-xh-am-lf-sn/jst-manufacturing?region=europe
X3 = B5B-XH-AM__LF__SN_: Connector; Manufacturer_Name: JST (JAPAN SOLDERLESS TERMINALS); Manufacturer_Part_Number: B5B-XH-AM (LF)(SN); Datasheet Link: http://uk.rs-online.com/web/p/products/1755317; Height: 7mm; Arrow Part Number: B5B-XH-AM (LF)(SN); Arrow Price/Stock: https://www.arrow.com/en/products/b5b-xh-am-lf-sn/jst-manufacturing
X4 = HU2032-LF: Undefined or Miscellaneous; Manufacturer_Name: RENATA; Datasheet Link: https://componentsearchengine.com/Datasheets/2/HU2032-LF.pdf; Manufacturer_Part_Number: HU2032-LF; Mouser Part Number: 614-HU2032-LF; Mouser Price/Stock: https://www.mouser.co.uk/ProductDetail/Renata/HU2032-LF?qs=oUsD4qhOtFwA99zRPu3JIQ%3D%3D
X6 = B4B-XH-AM__LF__SN_: Connector; Manufacturer_Name: JST (JAPAN SOLDERLESS TERMINALS); Manufacturer_Part_Number: B4B-XH-AM (LF)(SN); Datasheet Link: http://www.jst-mfg.com/product/pdf/eng/eXH.pdf; Height: 7mm; Arrow Part Number: B4B-XH-AM (LF)(SN); Arrow Price/Stock: https://www.arrow.com/en/products/b4b-xh-am-lf-sn/jst-manufacturing?region=europe
X8 = 104031-0811: Connector; Manufacturer_Name: Molex; Datasheet Link: http://www.molex.com/webdocs/datasheets/pdf/en-us/1040310811_MEMORY_CARD_SOCKET.pdf; Manufacturer_Part_Number: 104031-0811; Mouser Part Number: 538-104031-0811; Mouser Price/Stock: https://www.mouser.co.uk/ProductDetail/Molex/104031-0811?qs=udsGRKD4nA3Tvy7wqky%252BuA%3D%3D
Y1 = Q13FC1350000212: Crystal or Oscillator; Manufacturer_Name: Epson Timing; Datasheet Link: https://docs.rs-online.com/a620/0900766b80ce11f4.pdf; Height: 0.8mm; Manufacturer_Part_Number: Q13FC1350000212
Y2 = CC1V-T1A-1.8432MHZ-10PF-500PPM-TC-QC: Crystal or Oscillator; Manufacturer_Name: Micro Crystal AG; Datasheet Link: https://www.microcrystal.com/fileadmin/Media/Products/32kHz/Datasheet/CC1V-T1A.pdf; Height: 1.75mm; Manufacturer_Part_Number: CC1V-T1A-1.8432MHZ-10PF-500PPM-TC-QC; Mouser Part Number: 428-201112-ML01; Mouser Price/Stock: https://www.mouser.co.uk/ProductDetail/Micro-Crystal/CC1V-T1A-1.8432MHz-10pF-500PPM-TC-QC?qs=7bTaA%2FLYtSYjZKB5ii%2FQ6A%3D%3D